# EAGLE schematic overo (EAGLE 5.11)
DM: 0; DR: 180.000; DX: 63.800; DY: 20.600; SHEETNO: 2

## Sheet 1 of 11
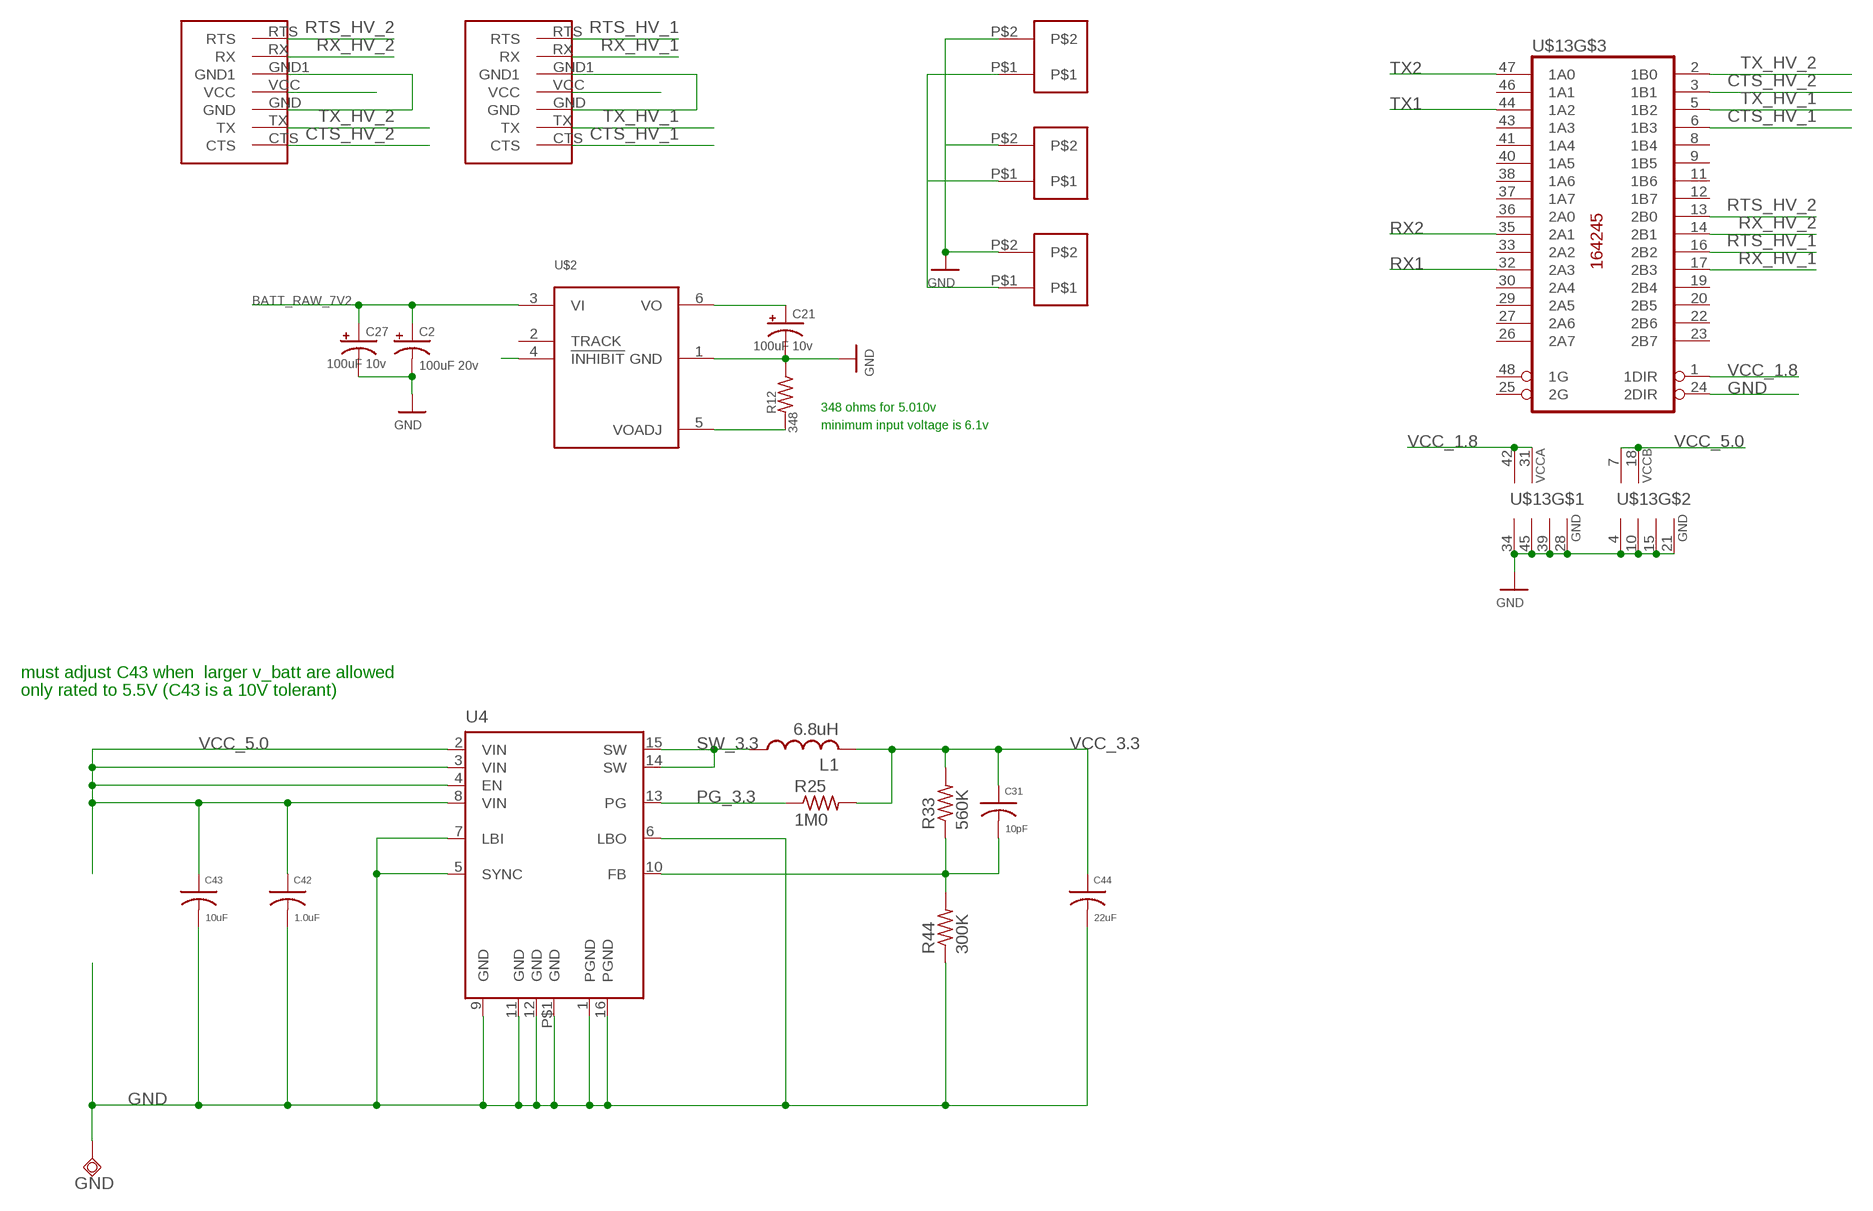
[diagram p0: schematic, sheet 1]

### Parts
C2  100uF 20v  CPOL-USE1.8-4  [E1,8-4]
C21  100uF 10v  CPOL-USE1.8-4  [E1,8-4]
C27  100uF 10v  CPOL-USE1.8-4  [E1,8-4]
C31  10pF  C0402  [C0402]
C42  1.0uF  C0603  [C0603]
C43  10uF  C0805  [C0805]
C44  22uF  C0805-R  [C0805R]
GND  TPSQPAD1-13  [P1-13]
L1  6.8uH  LELL3GM  [ELL3GM]
R12  348  R-US_R0603  [R0603]
R25  1M0  R0402-R  [C0402R]
R33  560K  R0402-R  [C0402R]
R44  300K  R0402-R  [C0402R]
U4  TPS62111  [PQFP16]
U$2  PTH08000W  [PTH08000W]
U$8  WASP7PIN  [WASP7PIN]
U$9  2P  [2PTH]
U$10  WASP7PIN  [WASP7PIN]
U$11  2P  [2PTH]
U$12  2P  [2PTH]
U$13  74AC-LOGIC_74AC164245TVSOP  [74AC-LOGIC_TVSOP48]

### Nets
BATT_RAW_7V2: C2.+ C27.+ U$2.3(VI)
CTS_HV_1: U$8.CTS U$13.6(1B3)
CTS_HV_2: U$10.CTS U$13.3(1B1)
FB_3.3: C31.2 R33.1 R44.2 U4.10(FB)
GND [supply]: C2.- C21.- C27.- C42.2 C43.2 C44.2 GND.TP R12.1 R44.1 U4.1(PGND) U4.5(SYNC) U4.6(LBO) U4.7(LBI) U4.9(GND) U4.11(GND) U4.12(GND) U4.16(PGND) U4.P$1(GND) U$2.1(GND) U$8.GND U$8.GND1 U$9.P$2 U$10.GND U$10.GND1 U$11.P$2 U$12.P$2 U$13.4(GND) U$13.10(GND) U$13.15(GND) U$13.21(GND) U$13.24(2DIR) U$13.28(GND) U$13.34(GND) U$13.39(GND) U$13.45(GND) ; also sheet 2,3,4,5,6,7,8,9,10
N$3: U$9.P$1 U$11.P$1 U$12.P$1
N$24: R12.2 U$2.5(VOADJ)
N$25: U$2.4(!INHIBIT)
PG_3.3: R25.1 U4.13(PG)
RTS_HV_1: U$8.RTS U$13.16(2B2)
RTS_HV_2: U$10.RTS U$13.13(2B0)
RX1: U$13.32(2A3) ; also sheet 3
RX2: U$13.35(2A1) ; also sheet 3
RX_HV_1: U$8.RX U$13.17(2B3)
RX_HV_2: U$10.RX U$13.14(2B1)
SW_3.3 [supply]: L1.1 U4.14(SW) U4.15(SW)
TX1: U$13.44(1A2) ; also sheet 3
TX2: U$13.47(1A0) ; also sheet 3
TX_HV_1: U$8.TX U$13.5(1B2)
TX_HV_2: U$10.TX U$13.2(1B0)
VCC_1.8 [supply]: U$13.1(1DIR) U$13.31(VCCA) U$13.42(VCCA) ; also sheet 3,4,5,7,8
VCC_3.3 [supply]: C31.1 C44.1 L1.2 R25.2 R33.2 ; also sheet 3,5,6,7,8,9,10
VCC_5.0: C21.+ C42.1 C43.1 U4.2(VIN) U4.3(VIN) U4.4(EN) U4.8(VIN) U$2.6(VO) U$8.VCC U$10.VCC U$13.7(VCCB) U$13.18(VCCB) ; also sheet 10
Unconnected: U$2.2(TRACK) U$13.8(1B4) U$13.9(1B5) U$13.11(1B6) U$13.12(1B7) U$13.19(2B4) U$13.20(2B5) U$13.22(2B6) U$13.23(2B7) U$13.25(2G) U$13.26(2A7) U$13.27(2A6) U$13.29(2A5) U$13.30(2A4) U$13.33(2A2) U$13.36(2A0) U$13.37(1A7) U$13.38(1A6) U$13.40(1A5) U$13.41(1A4) U$13.43(1A3) U$13.46(1A1) U$13.48(1G)

### Notes on the sheet
- 348 ohms for 5.010v
- minimum input voltage is 6.1v
- must adjust C43 when  larger v_batt are allowed
- only rated to 5.5V (C43 is a 10V tolerant)

## Sheet 2 of 11
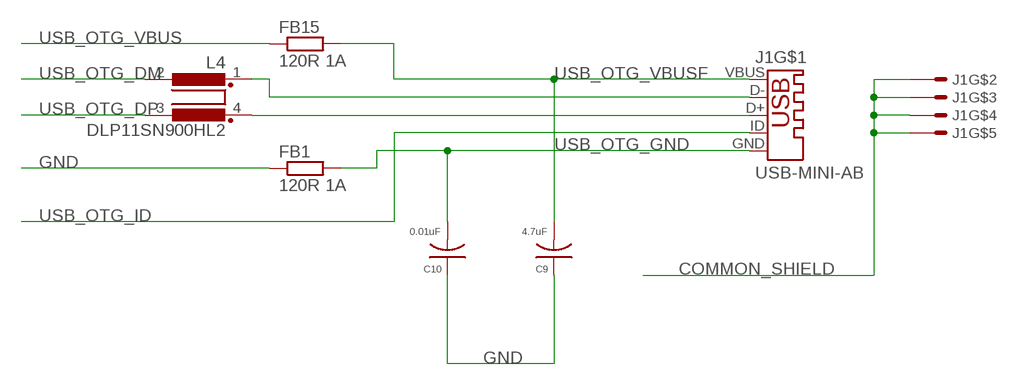
[diagram p1: schematic, sheet 2]

### Parts
C9  4.7uF  C0603-R  [C0603R]
C10  0.01uF  C0402  [C0402]
FB1  120R 1A  FB0402  [C0402]
FB15  120R 1A  FB0402  [C0402]
J1  USB-MINI-AB  USB-BUSB-MINI-AB-SMT  [USB-MINI-AB-SMT]
L4  DLP11SN900HL2  COM_MODE_CHOKE  [0504-DLP11S]

### Nets
COMMON_SHIELD [xxwide]: J1.P1(S) J1.P2(S) J1.P3(S) J1.P4(S)
GND [supply]: C9.1 C10.1 FB1.1 ; also sheet 1,3,4,5,6,7,8,9,10
OTG_DM: J1.D-(2_D-) L4.1
OTG_DP: J1.D+(3_D+) L4.4
USB_OTG_DM [USB]: L4.2 ; also sheet 3
USB_OTG_DP [USB]: L4.3 ; also sheet 3
USB_OTG_GND [xxwide]: C10.2 FB1.2 J1.GND(5_GND)
USB_OTG_ID: J1.ID(4_ID) ; also sheet 3
USB_OTG_VBUS [xxwide]: FB15.1 ; also sheet 3
USB_OTG_VBUSF [xxwide]: C9.2 FB15.2 J1.VBUS(1_VBUS)

## Sheet 3 of 11
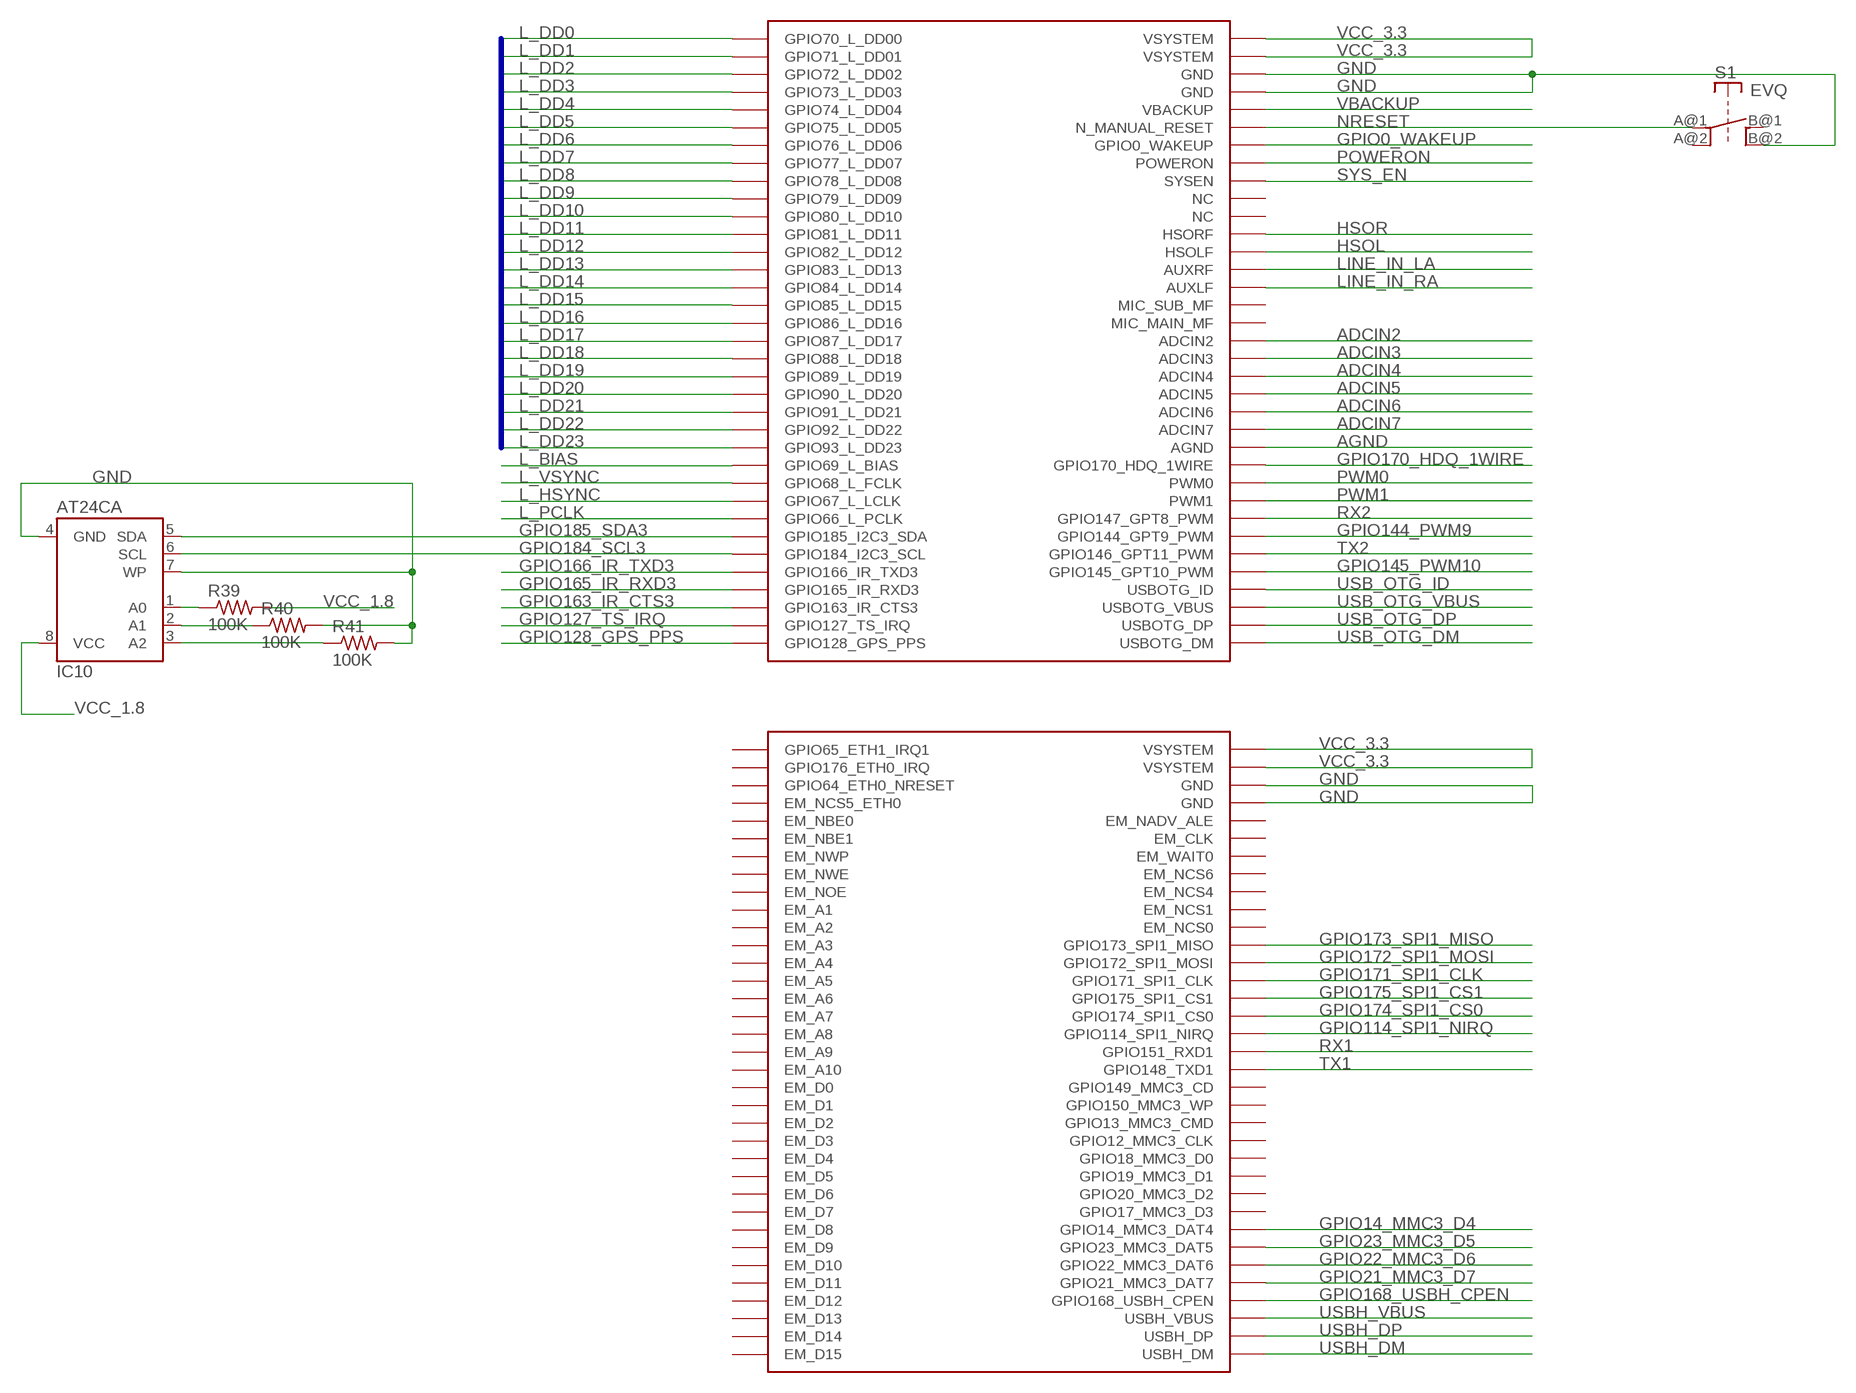
[diagram p2: schematic, sheet 3]

### Parts
IC10  AT24CA  [TSSOP8]
J3&4  OVERO  [OVERO]
R39  100K  R0402  [C0402]
R40  100K  R0402  [C0402]
R41  100K  R0402  [C0402]
S1  EVQ  [EVQ]

### Nets
ADCIN2 [analog]: J3&4.ADCIN2 ; also sheet 7
ADCIN3 [analog]: J3&4.ADCIN3 ; also sheet 7
ADCIN4 [analog]: J3&4.ADCIN4 ; also sheet 7
ADCIN5 [analog]: J3&4.ADCIN5 ; also sheet 7
ADCIN6 [analog]: J3&4.ADCIN6 ; also sheet 7
ADCIN7 [analog]: J3&4.ADCIN7 ; also sheet 7
AGND [supply]: J3&4.AGND ; also sheet 7
EE_A0: IC10.1(A0) R39.1
EE_A1: IC10.2(A1) R40.1
EE_A2: IC10.3(A2) R41.1
GND [supply]: IC10.4(GND) IC10.7(WP) J3&4.GND J3&4.GND@33(GND) J3&4.GND@56(GND) J3&4.GND@70(GND) R40.2 R41.2 S1.B@2(B') ; also sheet 1,2,4,5,6,7,8,9,10
GPIO0_WAKEUP: J3&4.GPIO0_WAKEUP ; also sheet 7
GPIO14_MMC3_D4: J3&4.GPIO14_MMC3_DAT4 ; also sheet 8
GPIO21_MMC3_D7: J3&4.GPIO21_MMC3_DAT7 ; also sheet 8
GPIO22_MMC3_D6: J3&4.GPIO22_MMC3_DAT6 ; also sheet 8
GPIO23_MMC3_D5: J3&4.GPIO23_MMC3_DAT5 ; also sheet 8
GPIO114_SPI1_NIRQ: J3&4.GPIO114_SPI1_NIRQ ; also sheet 7,8
GPIO127_TS_IRQ: J3&4.GPIO127_TS_IRQ ; also sheet 7
GPIO128_GPS_PPS: J3&4.GPIO128_GPS_PPS ; also sheet 7
GPIO144_PWM9: J3&4.GPIO144_GPT9_PWM ; also sheet 7,8
GPIO145_PWM10: J3&4.GPIO145_GPT10_PWM ; also sheet 7,9
GPIO163_IR_CTS3: J3&4.GPIO163_IR_CTS3 ; also sheet 7
GPIO165_IR_RXD3: J3&4.GPIO165_IR_RXD3 ; also sheet 4,7
GPIO166_IR_TXD3: J3&4.GPIO166_IR_TXD3 ; also sheet 4,7
GPIO168_USBH_CPEN: J3&4.GPIO168_USBH_CPEN
GPIO170_HDQ_1WIRE: J3&4.GPIO170_HDQ_1WIRE ; also sheet 7
GPIO171_SPI1_CLK: J3&4.GPIO171_SPI1_CLK ; also sheet 7,8
GPIO172_SPI1_MOSI: J3&4.GPIO172_SPI1_MOSI ; also sheet 7,8
GPIO173_SPI1_MISO: J3&4.GPIO173_SPI1_MISO ; also sheet 7,8
GPIO174_SPI1_CS0: J3&4.GPIO174_SPI1_CS0 ; also sheet 7,8
GPIO175_SPI1_CS1: J3&4.GPIO175_SPI1_CS1 ; also sheet 7,8
GPIO184_SCL3: IC10.6(SCL) J3&4.GPIO184_I2C3_SCL ; also sheet 7
GPIO185_SDA3: IC10.5(SDA) J3&4.GPIO185_I2C3_SDA ; also sheet 7
HSOL [analog]: J3&4.HSOLF
HSOR [analog]: J3&4.HSORF
L_BIAS: J3&4.GPIO69_L_BIAS ; also sheet 8
L_DD0: J3&4.GPIO70_L_DD00 ; also sheet 8
L_DD1: J3&4.GPIO71_L_DD01 ; also sheet 8
L_DD2: J3&4.GPIO72_L_DD02 ; also sheet 8
L_DD3: J3&4.GPIO73_L_DD03 ; also sheet 8
L_DD4: J3&4.GPIO74_L_DD04 ; also sheet 8
L_DD5: J3&4.GPIO75_L_DD05 ; also sheet 8
L_DD6: J3&4.GPIO76_L_DD06 ; also sheet 8
L_DD7: J3&4.GPIO77_L_DD07 ; also sheet 8
L_DD8: J3&4.GPIO78_L_DD08 ; also sheet 8
L_DD9: J3&4.GPIO79_L_DD09 ; also sheet 8
L_DD10: J3&4.GPIO80_L_DD10 ; also sheet 8
L_DD11: J3&4.GPIO81_L_DD11 ; also sheet 8
L_DD12: J3&4.GPIO82_L_DD12 ; also sheet 8
L_DD13: J3&4.GPIO83_L_DD13 ; also sheet 8
L_DD14: J3&4.GPIO84_L_DD14 ; also sheet 8
L_DD15: J3&4.GPIO85_L_DD15 ; also sheet 8
L_DD16: J3&4.GPIO86_L_DD16 ; also sheet 8
L_DD17: J3&4.GPIO87_L_DD17 ; also sheet 8
L_DD18: J3&4.GPIO88_L_DD18 ; also sheet 8
L_DD19: J3&4.GPIO89_L_DD19 ; also sheet 8
L_DD20: J3&4.GPIO90_L_DD20 ; also sheet 8
L_DD21: J3&4.GPIO91_L_DD21 ; also sheet 8
L_DD22: J3&4.GPIO92_L_DD22 ; also sheet 8
L_DD23: J3&4.GPIO93_L_DD23 ; also sheet 8
L_HSYNC: J3&4.GPIO67_L_LCLK ; also sheet 8
L_PCLK: J3&4.GPIO66_L_PCLK ; also sheet 8
L_VSYNC: J3&4.GPIO68_L_FCLK ; also sheet 8
LINE_IN_LA [analog]: J3&4.AUXRF
LINE_IN_RA [analog]: J3&4.AUXLF
NRESET: J3&4.N_MANUAL_RESET S1.A@1(A)
POWERON: J3&4.POWERON ; also sheet 7
PWM0: J3&4.PWM0 ; also sheet 7
PWM1: J3&4.PWM1 ; also sheet 7
RX1: J3&4.GPIO151_RXD1 ; also sheet 1
RX2: J3&4.GPIO147_GPT8_PWM ; also sheet 1
SYS_EN: J3&4.SYSEN ; also sheet 5,7,9
TX1: J3&4.GPIO148_TXD1 ; also sheet 1
TX2: J3&4.GPIO146_GPT11_PWM ; also sheet 1
USB_OTG_DM [USB]: J3&4.USBOTG_DM ; also sheet 2
USB_OTG_DP [USB]: J3&4.USBOTG_DP ; also sheet 2
USB_OTG_ID: J3&4.USBOTG_ID ; also sheet 2
USB_OTG_VBUS [xxwide]: J3&4.USBOTG_VBUS ; also sheet 2
USBH_DM [USB]: J3&4.USBH_DM ; also sheet 10
USBH_DP [USB]: J3&4.USBH_DP ; also sheet 10
USBH_VBUS [xxwide]: J3&4.USBH_VBUS
VBACKUP: J3&4.VBACKUP ; also sheet 5,7
VCC_1.8 [supply]: IC10.8(VCC) R39.2 ; also sheet 1,4,5,7,8
VCC_3.3 [supply]: J3&4.VSYSTEM@1(VSYSTEM) J3&4.VSYSTEM@2(VSYSTEM) J3&4.VSYSTEM@66(VSYSTEM) J3&4.VSYSTEM@67(VSYSTEM) ; also sheet 1,5,6,7,8,9,10
Unconnected: J3&4.EM_A1 J3&4.EM_A2 J3&4.EM_A3 J3&4.EM_A4 J3&4.EM_A5 J3&4.EM_A6 J3&4.EM_A7 J3&4.EM_A8 J3&4.EM_A9 J3&4.EM_A10 J3&4.EM_CLK J3&4.EM_D0 J3&4.EM_D1 J3&4.EM_D2 J3&4.EM_D3 J3&4.EM_D4 J3&4.EM_D5 J3&4.EM_D6 J3&4.EM_D7 J3&4.EM_D8 J3&4.EM_D9 J3&4.EM_D10 J3&4.EM_D11 J3&4.EM_D12 J3&4.EM_D13 J3&4.EM_D14 J3&4.EM_D15 J3&4.EM_NADV_ALE J3&4.EM_NBE0 J3&4.EM_NBE1 J3&4.EM_NCS0 J3&4.EM_NCS1 J3&4.EM_NCS4 J3&4.EM_NCS5_ETH0 J3&4.EM_NCS6 J3&4.EM_NOE J3&4.EM_NWE J3&4.EM_NWP J3&4.EM_WAIT0 J3&4.GPIO12_MMC3_CLK J3&4.GPIO13_MMC3_CMD J3&4.GPIO17_MMC3_D3 J3&4.GPIO18_MMC3_D0 J3&4.GPIO19_MMC3_D1 J3&4.GPIO20_MMC3_D2 J3&4.GPIO64_ETH0_NRESET J3&4.GPIO65_ETH1_IRQ1 J3&4.GPIO149_MMC3_CD J3&4.GPIO150_MMC3_WP J3&4.GPIO176_ETH0_IRQ J3&4.MIC_MAIN_MF J3&4.MIC_SUB_MF J3&4.NC@62(NC) J3&4.NC@63(NC) S1.A@2(A') S1.B@1(B)

### Buses
L_DD[0..23]

## Sheet 4 of 11
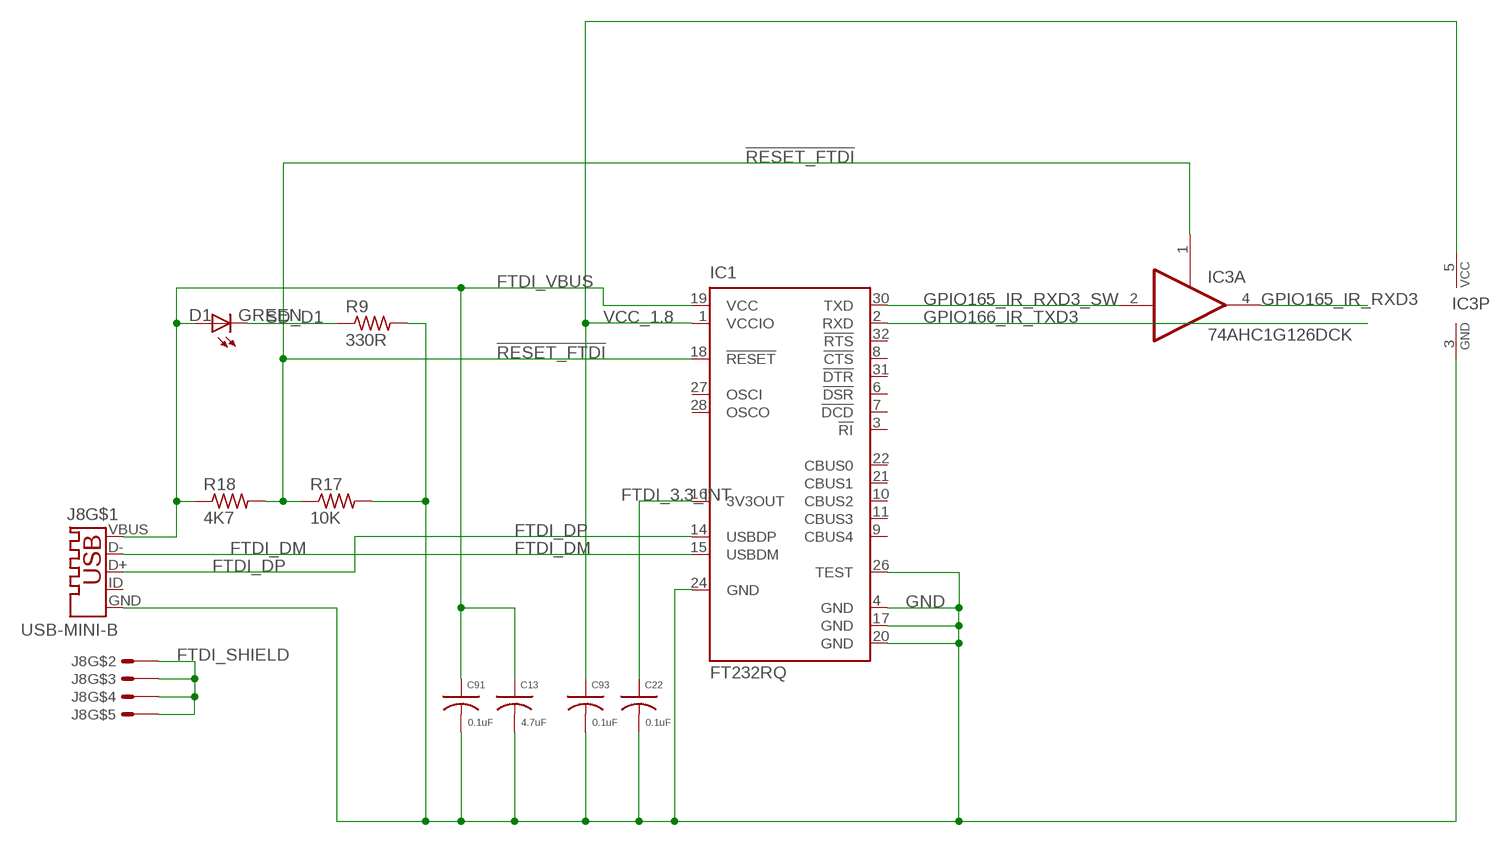
[diagram p3: schematic, sheet 4]

### Parts
C13  4.7uF  C0603-R  [C0603R]
C22  0.1uF  C0402  [C0402]
C91  0.1uF  C0402  [C0402]
C93  0.1uF  C0402-R  [C0402R]
D1  GREEN  LED0603  [D0603]
IC1  FT232RQ  [QFN32]
IC3  74AHC1G126DCK  [SC70-5]
J8  USB-MINI-B  USB-B  [USB-B-SMT]
R9  330R  R0402  [C0402]
R17  10K  R0402-R  [C0402R]
R18  4K7  R0402-R  [C0402R]

### Nets
!RESET_FTDI: IC1.18(!RESET) IC3.1(A:OE) R17.1 R18.2
FTDI_3.3_INT: C22.1 IC1.16(3V3OUT)
FTDI_DM: IC1.15(USBDM) J8.D-(2_D-)
FTDI_DP: IC1.14(USBDP) J8.D+(3_D+)
FTDI_SHIELD: J8.P1(S) J8.P2(S) J8.P3(S) J8.P4(S)
FTDI_VBUS [supply]: C13.1 C91.1 D1.A IC1.19(VCC) J8.VBUS(1_VBUS) R18.1
GND [supply]: C13.2 C22.2 C91.2 C93.2 IC1.4(GND) IC1.17(GND) IC1.20(GND) IC1.24(GND) IC1.26(TEST) IC3.3(P:GND) J8.GND(5_GND) R9.2 R17.2 ; also sheet 1,2,3,5,6,7,8,9,10
GPIO165_IR_RXD3: IC3.4(A:O) ; also sheet 3,7
GPIO165_IR_RXD3_SW: IC1.30(TXD) IC3.2(A:I)
GPIO166_IR_TXD3: IC1.2(RXD) ; also sheet 3,7
SD_D1: D1.C R9.1
VCC_1.8 [supply]: C93.1 IC1.1(VCCIO) IC3.5(P:VCC) ; also sheet 1,3,5,7,8
Unconnected: IC1.3(!RI) IC1.6(!DSR) IC1.7(!DCD) IC1.8(!CTS) IC1.9(CBUS4) IC1.10(CBUS2) IC1.11(CBUS3) IC1.21(CBUS1) IC1.22(CBUS0) IC1.27(OSCI) IC1.28(OSCO) IC1.31(!DTR) IC1.32(!RTS) J8.ID(4_ID)

## Sheet 5 of 11
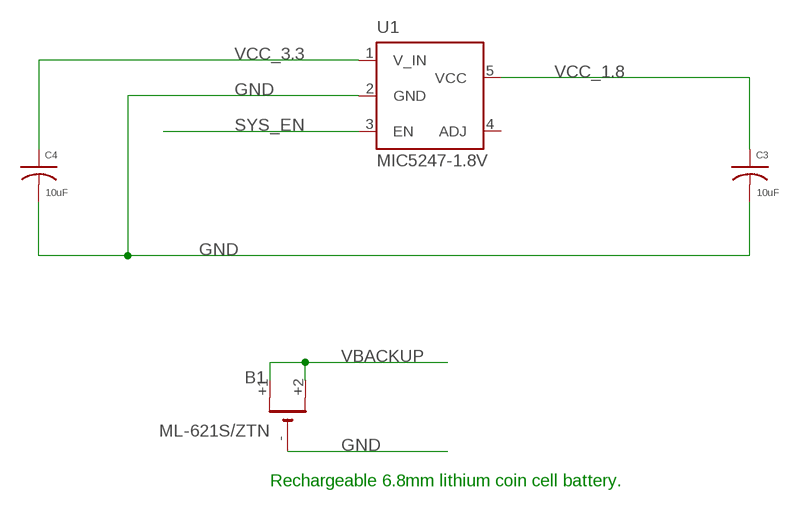
[diagram p4: schematic, sheet 5]

### Parts
B1  ML-621S/ZTN  COIN_CELL_6.8MM  [BATTERY_6.8MM-2998]
C3  10uF  C0603  [C0603]
C4  10uF  C0603-R  [C0603R]
U1  MIC5247-1.8V  MIC5219YM5  [SOT-23-5]

### Nets
GND [supply]: B1.- C3.2 C4.2 U1.2(GND) ; also sheet 1,2,3,4,6,7,8,9,10
SYS_EN: U1.3(EN) ; also sheet 3,7,9
VBACKUP: B1.+1 B1.+2 ; also sheet 3,7
VCC_1.8 [supply]: C3.1 U1.5(VCC) ; also sheet 1,3,4,7,8
VCC_3.3 [supply]: C4.1 U1.1(V_IN) ; also sheet 1,3,6,7,8,9,10
Unconnected: U1.4(ADJ)

### Notes on the sheet
- Rechargeable 6.8mm lithium coin cell battery.

## Sheet 6 of 11
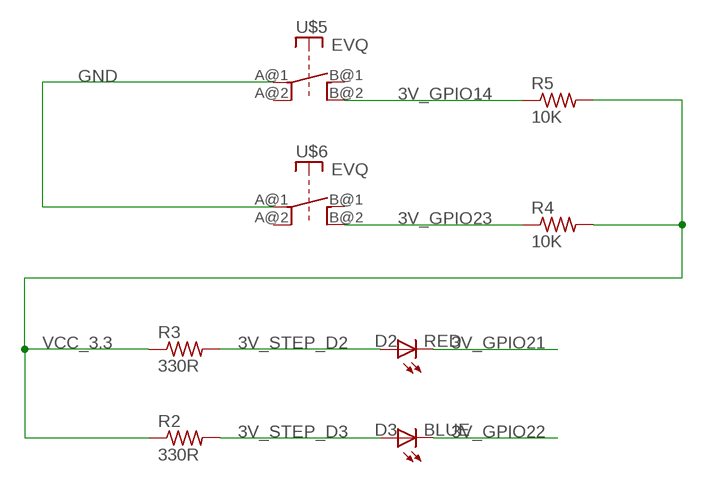
[diagram p5: schematic, sheet 6]

### Parts
D2  RED  LED0603-R  [D0603R]
D3  BLUE  LED0603  [D0603]
R2  330R  R0402-R  [C0402R]
R3  330R  R0402  [C0402]
R4  10K  R0402  [C0402]
R5  10K  R0402  [C0402]
U$5  EVQ  [EVQ]
U$6  EVQ  [EVQ]

### Nets
3V_GPIO14: R5.1 U$5.B@2(B') ; also sheet 8
3V_GPIO21: D2.C ; also sheet 8
3V_GPIO22: D3.C ; also sheet 8
3V_GPIO23: R4.1 U$6.B@2(B') ; also sheet 8
3V_STEP_D2: D2.A R3.2
3V_STEP_D3: D3.A R2.2
GND [supply]: U$5.A@1(A) U$6.A@1(A) ; also sheet 1,2,3,4,5,7,8,9,10
VCC_3.3 [supply]: R2.1 R3.1 R4.2 R5.2 ; also sheet 1,3,5,7,8,9,10
Unconnected: U$5.A@2(A') U$5.B@1(B) U$6.A@2(A') U$6.B@1(B)

## Sheet 7 of 11
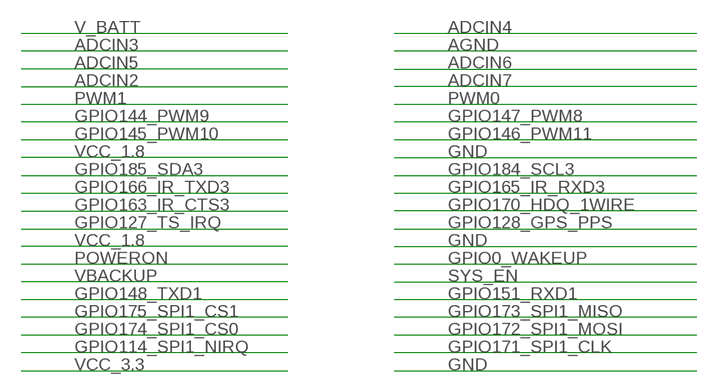
[diagram p6: schematic, sheet 7]

## Sheet 8 of 11
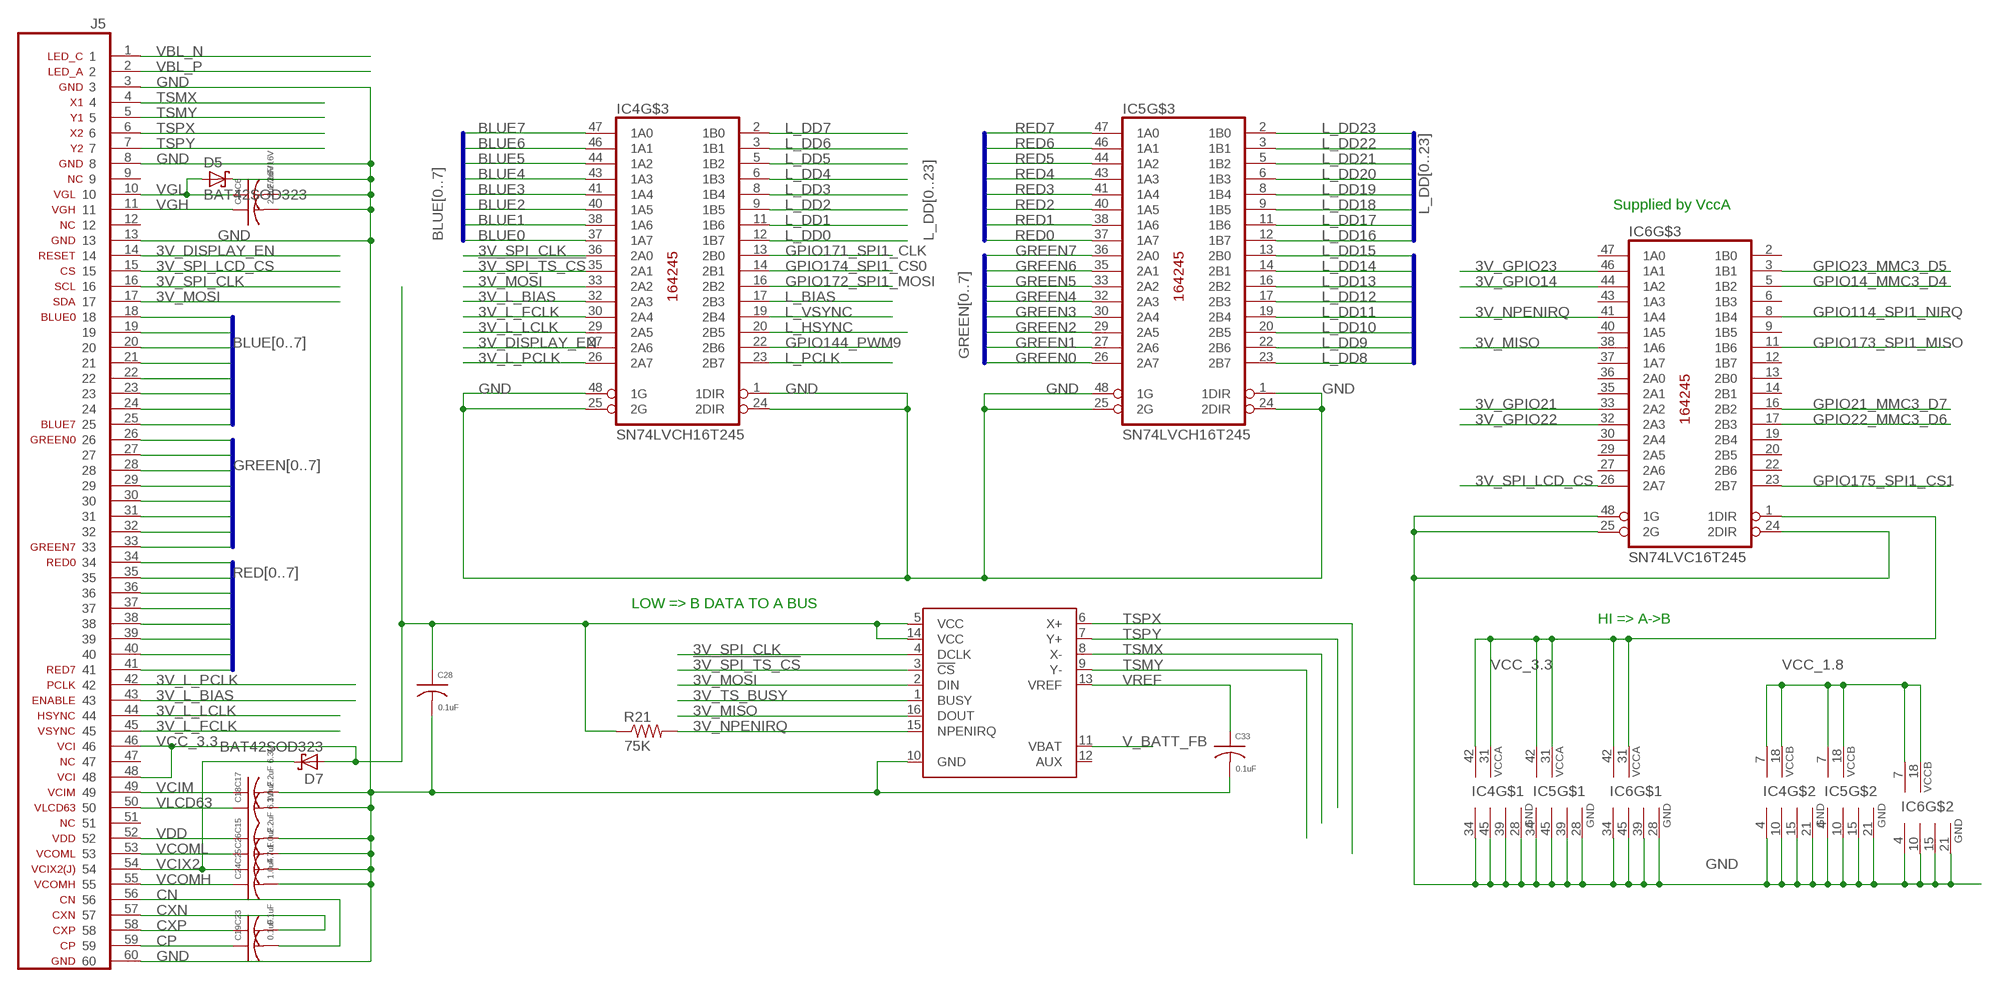
[diagram p7: schematic, sheet 8]

### Parts
C6  2.2uF/16V  C0603  [C0603]
C14  2.2uF/16V  C0603  [C0603]
C15  2.2uF 6.3V  C0603  [C0603]
C17  2.2uF 6.3V  C0603  [C0603]
C18  1.0uF  C0402  [C0402]
C19  0.1uF  C0402  [C0402]
C23  0.1uF  C0402  [C0402]
C24  1.0uF  C0402  [C0402]
C25  4.7uF  C0603  [C0603]
C26  1.0uF  C0402  [C0402]
C28  0.1uF  C0402  [C0402]
C33  0.1uF  C0402-R  [C0402R]
D5  BAT42SOD323  [SOD323-R]
D7  BAT42SOD323  [SOD323-R]
IC4  SN74LVCH16T245  74AC164245TVSOP  [TVSOP48]
IC5  SN74LVCH16T245  74AC164245TVSOP  [TVSOP48]
IC6  SN74LVC16T245  74AC164245TVSOP  [TVSOP48]
IC7  ADS7846RGV  [QFN16]
J5  FH12A-60  [FH12A-60-R]
R21  75K  R0402  [C0402]

### Nets
3V_DISPLAY_EN: IC4.27(2A6) J5.14
3V_GPIO14: IC6.44(1A2) ; also sheet 6
3V_GPIO21: IC6.33(2A2) ; also sheet 6
3V_GPIO22: IC6.32(2A3) ; also sheet 6
3V_GPIO23: IC6.46(1A1) ; also sheet 6
3V_L_BIAS: IC4.32(2A3) J5.43
3V_L_FCLK: IC4.30(2A4) J5.45
3V_L_LCLK: IC4.29(2A5) J5.44
3V_L_PCLK: IC4.26(2A7) J5.42
3V_MISO: IC6.38(1A6) IC7.16(DOUT)
3V_MOSI: IC4.33(2A2) IC7.2(DIN) J5.17
3V_NPENIRQ: IC6.41(1A4) IC7.15(NPENIRQ) R21.2
3V_SPI_CLK: IC4.36(2A0) IC7.4(DCLK) J5.16
3V_SPI_LCD_CS: IC6.26(2A7) J5.15
3V_TS_BUSY: IC7.1(BUSY)
!3V_SPI_TS_CS: IC4.35(2A1) IC7.3(!CS)
BLUE0: IC4.37(1A7) J5.18
BLUE1: IC4.38(1A6) J5.19
BLUE2: IC4.40(1A5) J5.20
BLUE3: IC4.41(1A4) J5.21
BLUE4: IC4.43(1A3) J5.22
BLUE5: IC4.44(1A2) J5.23
BLUE6: IC4.46(1A1) J5.24
BLUE7: IC4.47(1A0) J5.25
CN: C19.2 J5.56
CP: C19.1 J5.59
CXN: C23.2 J5.57
CXP: C23.1 J5.58
GND [supply]: C6.2 C14.2 C15.2 C17.2 C18.2 C24.2 C25.2 C26.2 C28.2 C33.2 D5.C IC4.1(1DIR) IC4.4(GND) IC4.10(GND) IC4.15(GND) IC4.21(GND) IC4.24(2DIR) IC4.25(2G) IC4.28(GND) IC4.34(GND) IC4.39(GND) IC4.45(GND) IC4.48(1G) IC5.1(1DIR) IC5.4(GND) IC5.10(GND) IC5.15(GND) IC5.21(GND) IC5.24(2DIR) IC5.25(2G) IC5.28(GND) IC5.34(GND) IC5.39(GND) IC5.45(GND) IC5.48(1G) IC6.4(GND) IC6.10(GND) IC6.15(GND) IC6.21(GND) IC6.24(2DIR) IC6.25(2G) IC6.28(GND) IC6.34(GND) IC6.39(GND) IC6.45(GND) IC6.48(1G) IC7.10(GND) J5.3 J5.8 J5.13 J5.60 ; also sheet 1,2,3,4,5,6,7,9,10
GPIO14_MMC3_D4: IC6.5(1B2) ; also sheet 3
GPIO21_MMC3_D7: IC6.16(2B2) ; also sheet 3
GPIO22_MMC3_D6: IC6.17(2B3) ; also sheet 3
GPIO23_MMC3_D5: IC6.3(1B1) ; also sheet 3
GPIO114_SPI1_NIRQ: IC6.8(1B4) ; also sheet 3,7
GPIO144_PWM9: IC4.22(2B6) ; also sheet 3,7
GPIO171_SPI1_CLK: IC4.13(2B0) ; also sheet 3,7
GPIO172_SPI1_MOSI: IC4.16(2B2) ; also sheet 3,7
GPIO173_SPI1_MISO: IC6.11(1B6) ; also sheet 3,7
GPIO174_SPI1_CS0: IC4.14(2B1) ; also sheet 3,7
GPIO175_SPI1_CS1: IC6.23(2B7) ; also sheet 3,7
GREEN0: IC5.26(2A7) J5.26
GREEN1: IC5.27(2A6) J5.27
GREEN2: IC5.29(2A5) J5.28
GREEN3: IC5.30(2A4) J5.29
GREEN4: IC5.32(2A3) J5.30
GREEN5: IC5.33(2A2) J5.31
GREEN6: IC5.35(2A1) J5.32
GREEN7: IC5.36(2A0) J5.33
L_BIAS: IC4.17(2B3) ; also sheet 3
L_DD0: IC4.12(1B7) ; also sheet 3
L_DD1: IC4.11(1B6) ; also sheet 3
L_DD2: IC4.9(1B5) ; also sheet 3
L_DD3: IC4.8(1B4) ; also sheet 3
L_DD4: IC4.6(1B3) ; also sheet 3
L_DD5: IC4.5(1B2) ; also sheet 3
L_DD6: IC4.3(1B1) ; also sheet 3
L_DD7: IC4.2(1B0) ; also sheet 3
L_DD8: IC5.23(2B7) ; also sheet 3
L_DD9: IC5.22(2B6) ; also sheet 3
L_DD10: IC5.20(2B5) ; also sheet 3
L_DD11: IC5.19(2B4) ; also sheet 3
L_DD12: IC5.17(2B3) ; also sheet 3
L_DD13: IC5.16(2B2) ; also sheet 3
L_DD14: IC5.14(2B1) ; also sheet 3
L_DD15: IC5.13(2B0) ; also sheet 3
L_DD16: IC5.12(1B7) ; also sheet 3
L_DD17: IC5.11(1B6) ; also sheet 3
L_DD18: IC5.9(1B5) ; also sheet 3
L_DD19: IC5.8(1B4) ; also sheet 3
L_DD20: IC5.6(1B3) ; also sheet 3
L_DD21: IC5.5(1B2) ; also sheet 3
L_DD22: IC5.3(1B1) ; also sheet 3
L_DD23: IC5.2(1B0) ; also sheet 3
L_HSYNC: IC4.20(2B5) ; also sheet 3
L_PCLK: IC4.23(2B7) ; also sheet 3
L_VSYNC: IC4.19(2B4) ; also sheet 3
RED0: IC5.37(1A7) J5.34
RED1: IC5.38(1A6) J5.35
RED2: IC5.40(1A5) J5.36
RED3: IC5.41(1A4) J5.37
RED4: IC5.43(1A3) J5.38
RED5: IC5.44(1A2) J5.39
RED6: IC5.46(1A1) J5.40
RED7: IC5.47(1A0) J5.41
TSMX [analog]: IC7.8(X-) J5.4
TSMY [analog]: IC7.9(Y-) J5.5
TSPX [analog]: IC7.6(X+) J5.6
TSPY [analog]: IC7.7(Y+) J5.7
V_BATT_FB: IC7.11(VBAT)
VBL_N [xxwide]: J5.1 ; also sheet 9
VBL_P [xxwide]: J5.2 ; also sheet 9
VCC_1.8 [supply]: IC4.7(VCCB) IC4.18(VCCB) IC5.7(VCCB) IC5.18(VCCB) IC6.7(VCCB) IC6.18(VCCB) ; also sheet 1,3,4,5,7
VCC_3.3 [supply]: C28.1 D7.A IC4.31(VCCA) IC4.42(VCCA) IC5.31(VCCA) IC5.42(VCCA) IC6.1(1DIR) IC6.31(VCCA) IC6.42(VCCA) IC7.5(VCC) IC7.14(VCC) J5.46 J5.48 R21.1 ; also sheet 1,3,5,6,7,9,10
VCIM: C17.1 J5.49
VCIX2: C25.1 D7.C J5.54
VCOMH: C24.1 J5.55
VCOML: C26.1 J5.53
VDD: C15.1 J5.52
VGH: C14.1 J5.11
VGL: C6.1 D5.A J5.10
VLCD63: C18.1 J5.50
VREF: C33.1 IC7.13(VREF)
Unconnected: IC6.2(1B0) IC6.6(1B3) IC6.9(1B5) IC6.12(1B7) IC6.13(2B0) IC6.14(2B1) IC6.19(2B4) IC6.20(2B5) IC6.22(2B6) IC6.27(2A6) IC6.29(2A5) IC6.30(2A4) IC6.35(2A1) IC6.36(2A0) IC6.37(1A7) IC6.40(1A5) IC6.43(1A3) IC6.47(1A0) IC7.12(AUX) J5.9 J5.12 J5.47 J5.51

### Buses
L_DD[0..23]
RED[0..7]
GREEN[0..7]
BLUE[0..7]

### Notes on the sheet
- Supplied by VccA
- LOW => B DATA TO A BUS
- HI => A->B

## Sheet 9 of 11
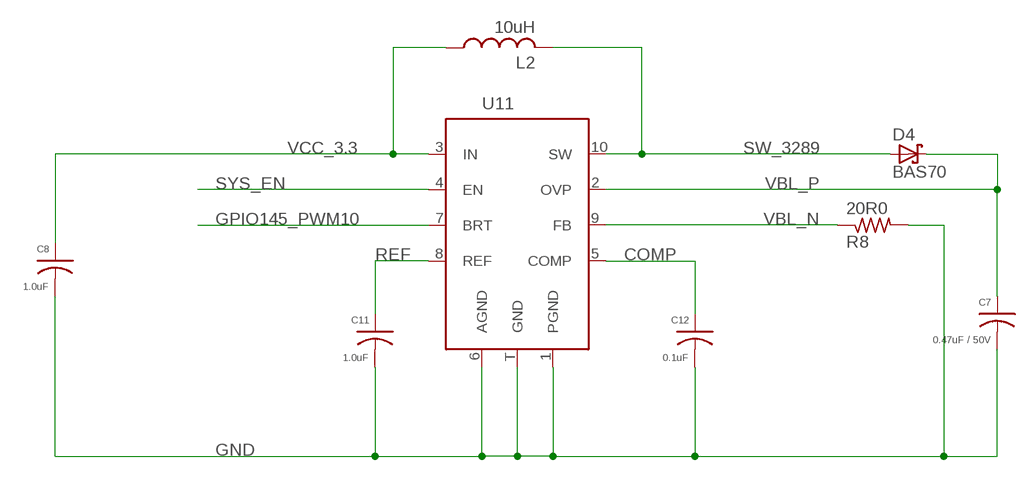
[diagram p8: schematic, sheet 9]

### Parts
C7  0.47uF / 50V  C1206  [C1206]
C8  1.0uF  C0603-R  [C0603R]
C11  1.0uF  C0402  [C0402]
C12  0.1uF  C0402  [C0402]
D4  BAS70  [SOT23]
L2  10uH  LELL3GM  [ELL3GM]
R8  20R0  R0402-R  [C0402R]
U11  MIC2297  [TDFN-10]

### Nets
COMP [xxwide]: C12.1 U11.5(COMP)
GND [supply]: C7.2 C8.2 C11.2 C12.2 R8.2 U11.1(PGND) U11.6(AGND) U11.T(GND) ; also sheet 1,2,3,4,5,6,7,8,10
GPIO145_PWM10: U11.7(BRT) ; also sheet 3,7
REF [xxwide]: C11.1 U11.8(REF)
SW_3289 [xxwide]: D4.1(A) L2.2 U11.10(SW)
SYS_EN: U11.4(EN) ; also sheet 3,5,7
VBL_N [xxwide]: R8.1 U11.9(FB) ; also sheet 8
VBL_P [xxwide]: C7.1 D4.3(C) U11.2(OVP) ; also sheet 8
VCC_3.3 [supply]: C8.1 L2.1 U11.3(IN) ; also sheet 1,3,5,6,7,8,10

## Sheet 10 of 11
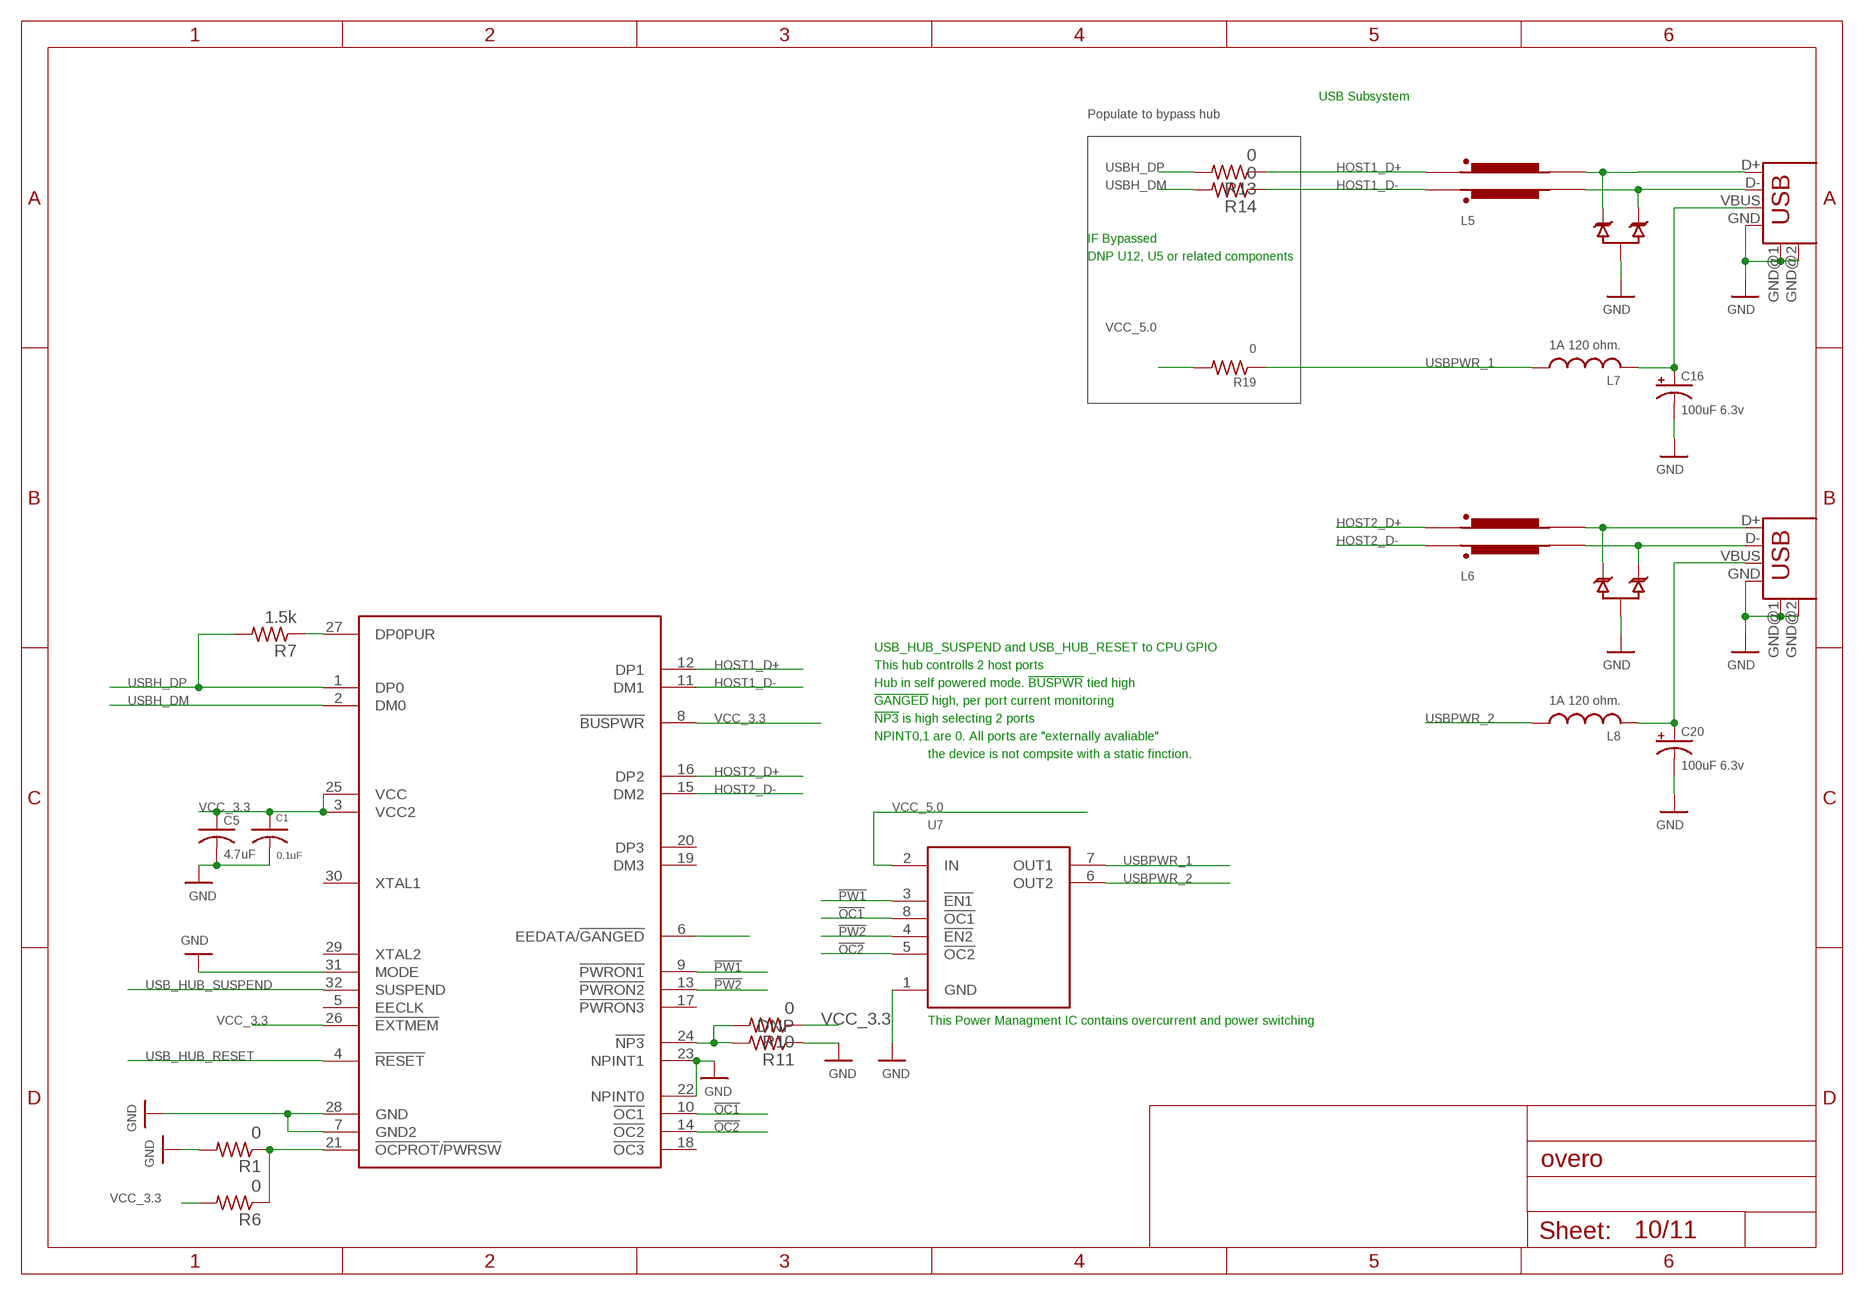
[diagram p9: schematic, sheet 10]

### Parts
C1  0.1uF  C0402-R  [C0402R]
C5  4.7uF  C-USC0603  [C0603]
C16  100uF 6.3v  CPOL-USE1.8-4  [E1,8-4]
C20  100uF 6.3v  CPOL-USE1.8-4  [E1,8-4]
L5  FERITE_S0805  [SPLIT_0805]
L6  FERITE_S0805  [SPLIT_0805]
L7  1A 120 ohm.  L-USL2825P  [L2825P]
L8  1A 120 ohm.  L-USL2825P  [L2825P]
R1  0  R0402-R  [C0402R]
R6  0  R0402-R  [C0402R]
R7  1.5k  R0402-R  [C0402R]
R10  0  R0402-R  [C0402R]
R11  DNP  R0402-R  [C0402R]
R13  0  R0402-R  [C0402R]
R14  0  R0402-R  [C0402R]
R19  0  R-US_R0603  [R0603]
U5  RCLAMP0502B  [SOT-523]
U6  RCLAMP0502B  [SOT-523]
U7  TPS2042BDR  [SO08]
U12  TUSB2036  [S-PQFP-G32]
USB1  USB-A-H  [USB-A-H]
USB2  USB-A-H  [USB-A-H]

### Nets
!OC1: U7.8(!OC1) U12.10(!OC1)
!OC2: U7.5(!OC2) U12.14(!OC2)
!PW1: U7.3(!EN1) U12.9(!PWRON1)
!PW2: U7.4(!EN2) U12.13(!PWRON2)
GND [supply]: C1.2 C5.2 C16.- C20.- R1.2 R11.1 U5.3 U6.3 U7.1(GND) U12.7(GND2) U12.22(NPINT0) U12.23(NPINT1) U12.28(GND) U12.31(MODE) USB1.GND USB1.GND@1(GND) USB1.GND@2(GND) USB2.GND USB2.GND@1(GND) USB2.GND@2(GND) ; also sheet 1,2,3,4,5,6,7,8,9
HOST1_D+: L5.1 R13.1 U12.12(DP1)
HOST1_D+_UNFILTERED: L5.2 U5.2 USB1.D+
HOST1_D-: L5.4 R14.1 U12.11(DM1)
HOST1_D-_UNFILTERED: L5.3 U5.1 USB1.D-
HOST2_D+: L6.1 U12.16(DP2)
HOST2_D-: L6.4 U12.15(DM2)
N$1: R1.1 R6.1 U12.21(!OCPROT!/!PWRSW)
N$2: L6.3 U6.1 USB2.D-
N$7: R7.1 U12.27(DP0PUR)
N$9: L6.2 U6.2 USB2.D+
N$10: C16.+ L7.2 USB1.VBUS
N$11: R10.2 R11.2 U12.24(!NP3)
N$12: C20.+ L8.2 USB2.VBUS
USB_HUB_RESET: U12.4(!RESET)
USB_HUB_SUSPEND: U12.32(SUSPEND)
USBH_DM [USB]: R14.2 U12.2(DM0) ; also sheet 3
USBH_DP [USB]: R7.2 R13.2 U12.1(DP0) ; also sheet 3
USBPWR_1: L7.1 R19.1 U7.7(OUT1)
USBPWR_2: L8.1 U7.6(OUT2)
VCC_3.3 [supply]: C1.1 C5.1 R6.2 R10.1 U12.3(VCC2) U12.6(EEDATA/!GANGED) U12.8(!BUSPWR) U12.25(VCC) U12.26(!EXTMEM) ; also sheet 1,3,5,6,7,8,9
VCC_5.0: R19.2 U7.2(IN) ; also sheet 1
Unconnected: U12.5(EECLK) U12.17(!PWRON3) U12.18(!OC3) U12.19(DM3) U12.20(DP3) U12.29(XTAL2) U12.30(XTAL1)

### Notes on the sheet
- USB Subsystem
- Populate to bypass hub
- IF Bypassed
- DNP U12, U5 or related components
- USB_HUB_SUSPEND and USB_HUB_RESET to CPU GPIO
- This hub controlls 2 host ports
- Hub in self powered mode. !BUSPWR! tied high
- !GANGED! high, per port current monitoring
- !NP3! is high selecting 2 ports
- NPINT0,1 are 0. All ports are "externally avaliable"
- the device is not compsite with a static finction.
- This Power Managment IC contains overcurrent and power switching

## Sheet 11 of 11

## Library data of the parts
B1 = qualified_MSD:COIN_CELL_6.8MM
C1 C3 C4 C6-C15 C17-C19 C22-C26 C28 C31 C33 C42-C44 C91 C93 = qualified_1:C
C2 C21 C27 = resistor:CPOL-US: POLARIZED CAPACITOR, American symbol
C5 = rcl:C-US: CAPACITOR, American symbol
C16 C20 = rcl:CPOL-US: POLARIZED CAPACITOR, American symbol
D1-D3 = qualified_1:LED
D4 = diode:BAS70: Silicon Schottky Diodes General-purpose diode for high-speed switching
D5 D7 = diode-1:BAT42: DIODE barrier diode
FB1 FB15 = qualified_1:FB
GND = testpad:TPSQ: Test pad
IC1 = ftdichip:FT232R: Source: http://www.ftdichip.com/Documents/DataSheets/DS_FT232R_v104.pdf
IC3 = 74xx-little-gum:74*1G126: Single Bus Buffer Gate With 3-State Outputs
IC4-IC6 = 74ac-logic:74AC164245
IC7 = qualified_1:ADS7846
IC10 = atmel:AT24C*: 2-wire serial EEPROM
J1 J8 = qualified_1:USB-B
J3&4 = qualified_1:OVERO
J5 = qualified_1:FH12A-60
L1 L2 = qualified_1:L
L4 = qualified_MSD:COM_MODE_CHOKE
L5 L6 = ferrite_split_0805:FERITE_S0805
L7 L8 = rcl:L-US: INDUCTOR, American symbol
R1-R11 R13 R14 R17 R18 R21 R25 R33 R39-R41 R44 = qualified_1:R
R12 R19 = rcl:R-US_: RESISTOR, American symbol
S1 U$5 U$6 = qualified_1:EVQ
U1 = qualified_1:MIC5219
U4 = qualified_1:TPS62111
U5 U6 = rclamp0502b:RCLAMP0502B
U7 = TPS2042BDR:TPS2042BDR
U11 = qualified_1:MIC2297
U12 = tusb2036:TUSB2036
U$2 = PTH0800W:PTH08000W
U$8 U$10 = wasp7pin:WASP7PIN
U$9 U$11 U$12 = con_2h_70555-0001:2P
U$13 = PCB30035:74AC-LOGIC_74AC164245
USB1 USB2 = con-usb-2:USB: USB Connectors

## Net classes
5 USB: width 0.191 mm